# EAGLE design mainBoard (EAGLE 9.6.2)
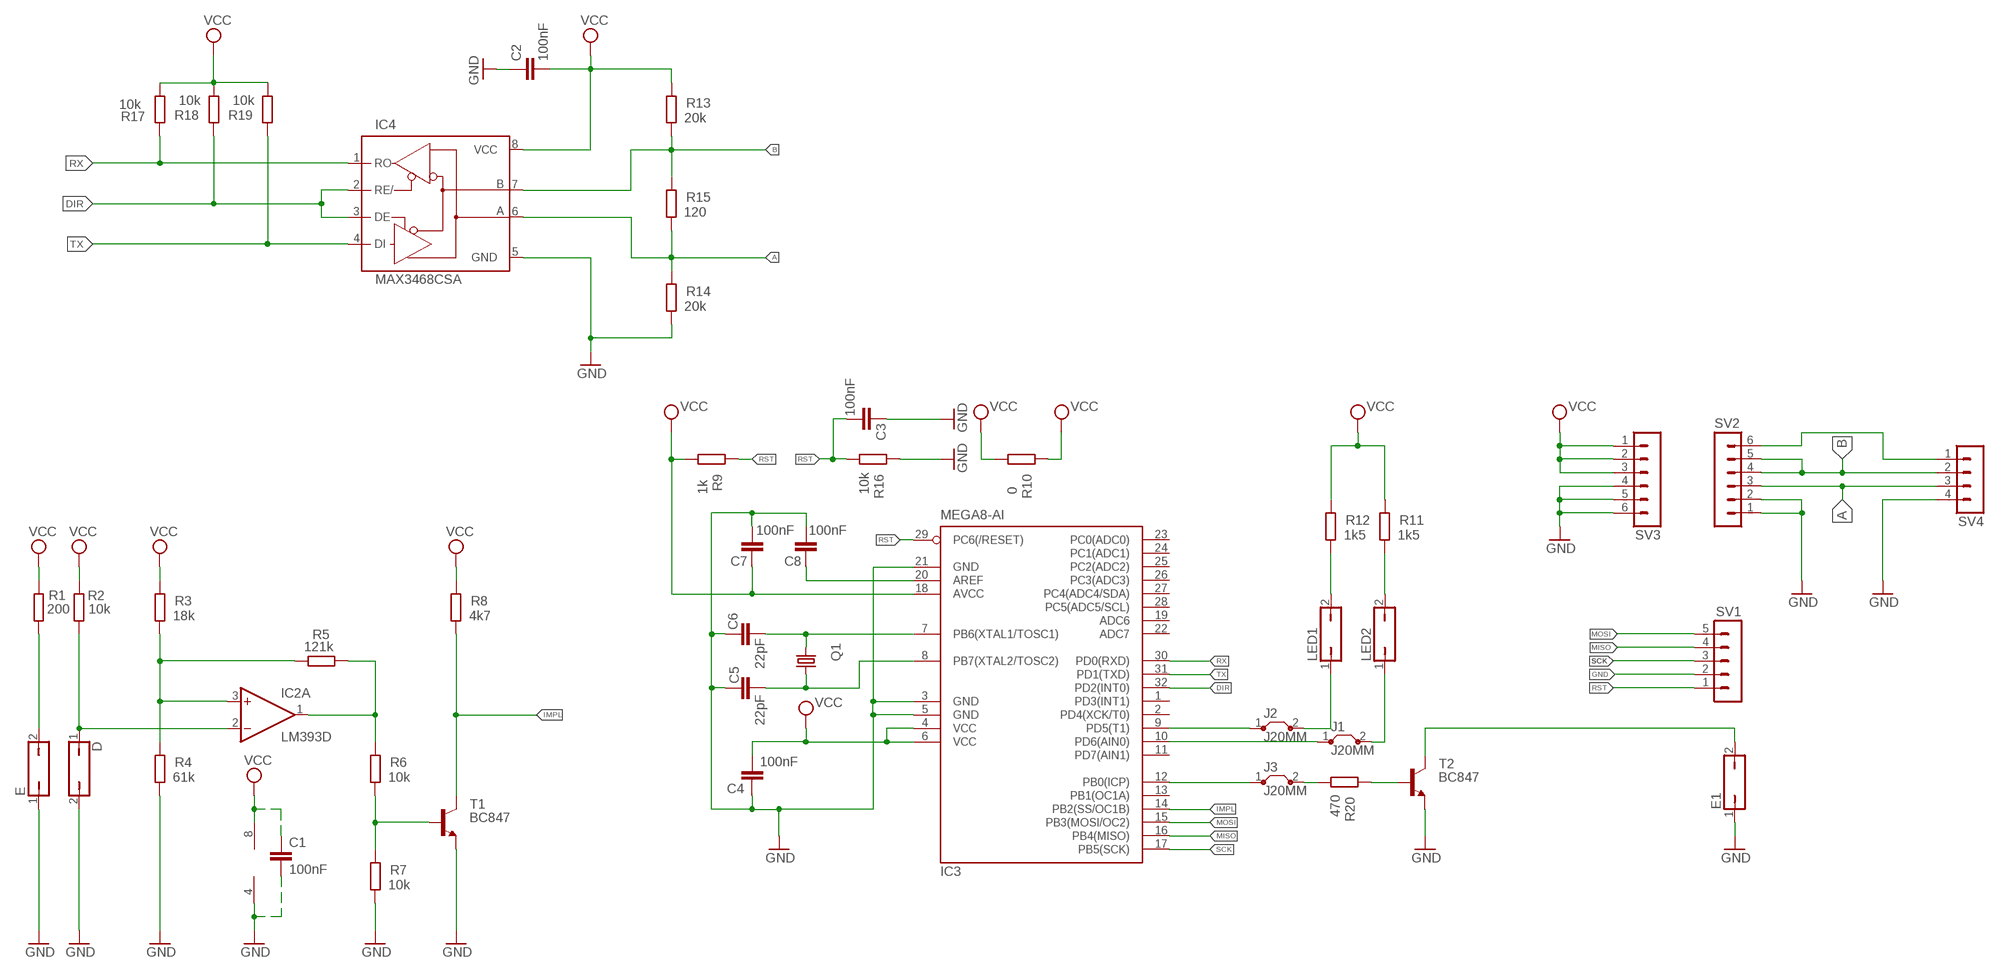
[diagram p0: schematic, sheet 1]

## Parts
C1  100nF  C-EUC1206K  [C1206K]
C2  100nF  C-EUC1206K  [C1206K]
C3  100nF  C-EUC1206K  [C1206K]
C4  100nF  C-EUC1206K  [C1206K]
C5  22pF  C-EUC1206K  [C1206K]
C6  22pF  C-EUC1206K  [C1206K]
C7  100nF  C-EUC1206K  [C1206K]
C8  100nF  C-EUC1206K  [C1206K]
D  JP1Q  [JP1]
E  JP1Q  [JP1]
E1  JP1Q  [JP1]
IC2  LM393D  [SO08]
IC3  MEGA8-AI  [TQFP32-08]
IC4  MAX3468CSA  [SO08]
J1  J20MM  [20]
J2  J20MM  [20]
J3  J20MM  [20]
LED1  JP1Q  [JP1]
LED2  JP1Q  [JP1]
Q1  CRYSTALSM49  [SM49]
R1  200  R-EU_M1206  [M1206]
R2  10k  R-EU_M1206  [M1206]
R3  18k  R-EU_M1206  [M1206]
R4  61k  R-EU_M1206  [M1206]
R5  121k  R-EU_M1206  [M1206]
R6  10k  R-EU_M1206  [M1206]
R7  10k  R-EU_M1206  [M1206]
R8  4k7  R-EU_M1206  [M1206]
R9  1k  R-EU_M1206  [M1206]
R10  0  R-EU_M1206  [M1206]
R11  1k5  R-EU_M1206  [M1206]
R12  1k5  R-EU_M1206  [M1206]
R13  20k  R-EU_M1206  [M1206]
R14  20k  R-EU_M1206  [M1206]
R15  120  R-EU_M1206  [M1206]
R16  10k  R-EU_M1206  [M1206]
R17  10k  R-EU_M1206  [M1206]
R18  10k  R-EU_M1206  [M1206]
R19  10k  R-EU_M1206  [M1206]
R20  470  R-EU_M1206  [M1206]
SV1  MA05-1  [MA05-1]
SV2  MA06-1  [MA06-1]
SV3  MA06-1  [MA06-1]
SV4  MA04-1  [MA04-1]
T1  BC847  [SOT23]
T2  BC847  [SOT23]

## Nets
A: IC4.6(A) R14.2 R15.1 SV2.3 SV4.3
B: IC4.7(B) R13.1 R15.2 SV2.4 SV2.5 SV4.2
DIR: IC3.32(PD2(INT0)) IC4.2(RE/) IC4.3(DE) R18.2
GND: C1.2 C2.1 C3.1 C4.1 C5.1 C6.1 C7.2 C8.2 D.2 E1.1 E.1 IC2.4(P:V-) IC3.3(GND) IC3.5(GND) IC3.21(GND) IC4.5(GND) R4.1 R7.1 R14.1 R16.2 SV1.2 SV2.1 SV2.2 SV3.4 SV3.5 SV3.6 SV4.4 T1.2(E) T2.2(E)
IMPL: IC3.14(PB2(SS/OC1B)) R8.1 T1.3(C)
MISO: IC3.16(PB4(MISO)) SV1.4
MOSI: IC3.15(PB3(MOSI/OC2)) SV1.5
N$1: E.2 R1.1
N$2: D.1 IC2.2(A:-IN) R2.2
N$3: IC2.3(A:+IN) R3.1 R4.2 R5.2
N$4: R6.1 R7.2 T1.1(B)
N$5: IC2.1(A:OUT) R5.1 R6.2
N$6: SV2.6 SV4.1
N$7: LED2.2 R11.1
N$8: LED1.2 R12.1
N$9: C5.2 IC3.8(PB7(XTAL2/TOSC2)) Q1.1
N$10: C8.1 IC3.20(AREF)
N$11: C6.2 IC3.7(PB6(XTAL1/TOSC1)) Q1.2
N$12: J2.2 LED1.1
N$14: J1.2 LED2.1
N$15: IC3.9(PD5(T1)) J2.1
N$16: IC3.10(PD6(AIN0)) J1.1
N$17: IC3.12(PB0(ICP)) J3.1
N$18: J3.2 R20.1
N$19: E1.2 T2.3(C)
N$20: R20.2 T2.1(B)
RST: C3.2 IC3.29(PC6(/RESET)) R9.2 R16.1 SV1.1
RX: IC3.30(PD0(RXD)) IC4.1(RO) R17.1
SCK: IC3.17(PB5(SCK)) SV1.3
TX: IC3.31(PD1(TXD)) IC4.4(DI) R19.2
VCC: C1.1 C2.2 C4.2 C7.1 IC2.8(P:V+) IC3.4(VCC) IC3.6(VCC) IC3.18(AVCC) IC4.8(VCC) R1.2 R2.1 R3.2 R8.2 R9.1 R10.1 R10.2 R11.2 R12.2 R13.2 R17.2 R18.1 R19.1 SV3.1 SV3.2 SV3.3
Unconnected: IC2.5(B:+IN) IC2.6(B:-IN) IC2.7(B:OUT) IC3.1(PD3(INT1)) IC3.2(PD4(XCK/T0)) IC3.11(PD7(AIN1)) IC3.13(PB1(OC1A)) IC3.19(ADC6) IC3.22(ADC7) IC3.23(PC0(ADC0)) IC3.24(PC1(ADC1)) IC3.25(PC2(ADC2)) IC3.26(PC3(ADC3)) IC3.27(PC4(ADC4/SDA)) IC3.28(PC5(ADC5/SCL))

## Library data of the parts
C1-C8 = rcl:C-EU: CAPACITOR, European symbol; SPICEPREFIX: C
D E E1 LED1 LED2 = jumper:JP1Q: JUMPER
IC2 = linear3:LM393: COMPARATOR
IC3 = atmel:MEGA8: MICROCONTROLLER 8 Kbytes FLASH, 1 kbytes SRAM, 512 bytes EEPROM, USART, 6-channel 10 bit ADC, 2-channel 8 bit ADC Pin compatible with Atmega48, ATMega88, ATMega168 Source: avr.lbr; MPN: ATMEGA8-16AU; OC_FARNELL: 9171371; OC_NEWARK: 73M8863
IC4 = maxim:MAX34*: +5V, Fail-Safe, 40Mbps, Profibus RS-485/RS-422 Transceivers Source: MAX3465-MAX3469.pdf; MPN: MAX3468CSA+; OC_FARNELL: unknown; OC_NEWARK: 76K6721
J1-J3 = jumper:J: Bridge
Q1 = crystal:CRYSTAL: CRYSTAL; OC_FARNELL: unknown; OC_NEWARK: unknown
R1-R20 = rcl:R-EU_: RESISTOR, European symbol; SPICEPREFIX: R
SV1 = con-lstb:MA05-1: PIN HEADER; OC_FARNELL: unknown; OC_NEWARK: unknown
SV2 SV3 = con-lstb:MA06-1: PIN HEADER; OC_FARNELL: unknown; OC_NEWARK: unknown
SV4 = con-lstb:MA04-1: PIN HEADER; OC_FARNELL: unknown; OC_NEWARK: unknown
T1 T2 = transistor:BC847: NPN TRANSISTOR

## Module POWERDC/DC
Ports: 

### Library data of the parts

## Board
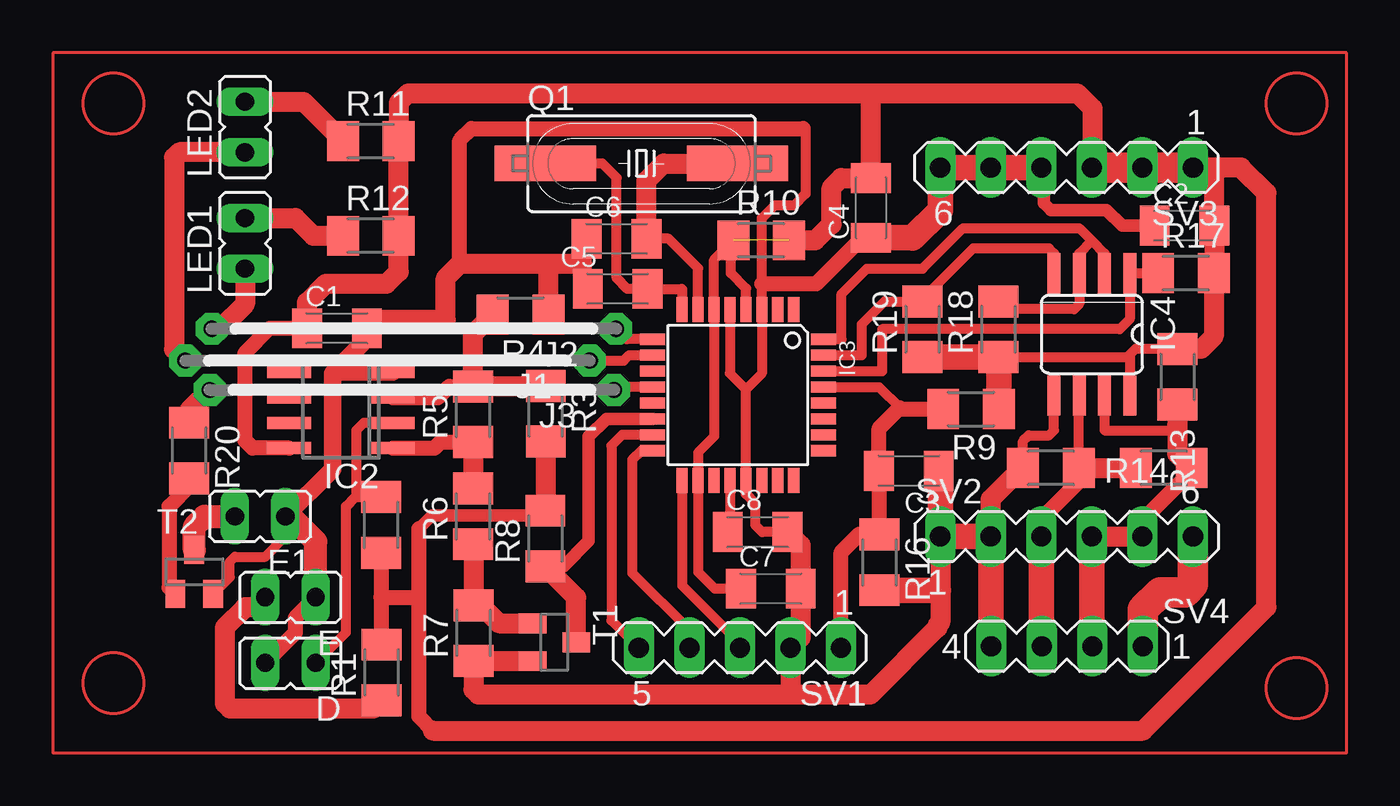
[diagram p1: board, top side]

No outline drawn. Coordinates in mm, seen from the top.
Copper layers (1*16): Top 0.035mm / dielectric 1.5mm / Bottom 0.035mm
Design rules "default *": minimum track width 20mil, minimum drill 0.35mm, track to track 6mil, track to pad 6mil, pad to pad 6mil, via to via 6mil, smd to smd 6mil, copper to edge 40mil, drill to drill 6mil, minimum pad ring 10mil, minimum via ring 8mil, stop-mask expansion 4mil, vias tented up to drill 0mil, thermal gap 10mil

### Footprints (pad centres in the part's own frame; a part is rotated, then mirrored left to right if it is on the bottom)
C1206K = smd 1.5 x 2: 1 -1.5,0; 2 1.5,0
JP1 = drill 0.914 long: 1 0,-1.27; 2 0,1.27
SO08 = smd 0.6 x 2.2: 1 -1.905,-2.6; 2 -0.635,-2.6; 3 0.635,-2.6; 4 1.905,-2.6; 5 1.905,2.6; 6 0.635,2.6; 7 -0.635,2.6; 8 -1.905,2.6
TQFP32-08 = smd 1.27 x 0.559: 1 -4.293,2.8; 2 -4.293,2; 3 -4.293,1.2; 4 -4.293,0.4; 5 -4.293,-0.4; 6 -4.293,-1.2; 7 -4.293,-2; 8 -4.293,-2.8; 17 4.293,-2.8; 18 4.293,-2; 19 4.293,-1.2; 20 4.293,-0.4; 21 4.293,0.4; 22 4.293,1.2; 23 4.293,2; 24 4.293,2.8 | smd 0.559 x 1.27: 9 -2.8,-4.293; 10 -2,-4.293; 11 -1.2,-4.293; 12 -0.4,-4.293; 13 0.4,-4.293; 14 1.2,-4.293; 15 2,-4.293; 16 2.8,-4.293; 25 2.8,4.293; 26 2,4.293; 27 1.2,4.293; 28 0.4,4.293; 29 -0.4,4.293; 30 -1.2,4.293; 31 -2,4.293; 32 -2.8,4.293
SO08' = smd 0.66 x 2.032: 1 -1.905,-3.073; 2 -0.635,-3.073; 3 0.635,-3.073; 4 1.905,-3.073; 5 1.905,3.073; 6 0.635,3.073; 7 -0.635,3.073; 8 -1.905,3.073
20 = drill 0.813 pad 1.6 octagon: 1 -10.16,0; 2 10.16,0
SM49 = smd 5.08 x 1.778: 1 -4.826,0; 2 4.826,0
M1206 = smd 1.6 x 2: 1 -1.4,0; 2 1.4,0
MA05-1 = drill 1.016 long: 1 -5.08,0; 2 -2.54,0; 3 0,0; 4 2.54,0; 5 5.08,0
MA06-1 = drill 1.016 long: 1 -6.35,0; 2 -3.81,0; 3 -1.27,0; 4 1.27,0; 5 3.81,0; 6 6.35,0
MA04-1 = drill 1.016 long: 1 -3.81,0; 2 -1.27,0; 3 1.27,0; 4 3.81,0
SOT23 = smd 1 x 1.4: 1 -0.95,-1.1; 2 0.95,-1.1; 3 0,1.1

### Placement (x,y rotation side)
C1  9.19,20.37 0 top
C2  51.77,25.53 0 top
C3  37.92,13.21 180 top
C4  36.02,26.42 90 top
C5  23.29,22.35 0 top
C6  23.24,24.87 0 top
C7  30.99,7.29 0 top
C8  30.33,10.13 0 top
D  6.86,3.56 90 top
E  6.86,6.86 90 top
E1  5.33,10.92 90 top
IC2  9.4,16.26 90 top
IC3  29.34,17.02 270 top
IC4  MAX3468CSA  [SO08']  47.12,20.07 180 top
J1  11.73,18.75 180 top
J2  13.06,20.35 180 top
J3  12.95,17.27 180 top
LED1  4.57,24.64 0 top
LED2  4.57,30.48 0 top
Q1  24.49,28.65 0 top
R1  11.43,3.07 90 top
R2  11.4,10.49 90 top
R3  19.68,16.08 270 top
R4  18.41,21.06 180 top
R5  16.03,16.05 90 top
R6  16.03,10.92 90 top
R7  16.05,5.05 90 top
R8  19.66,9.8 90 top
R9  41.05,16.31 180 top
R10  30.51,24.79 0 top
R11  10.9,29.77 0 top
R12  10.9,25.02 0 top
R13  51.41,17.93 90 top
R14  45.06,13.36 0 top
R15  50.72,13.36 0 top
R16  36.45,8.61 270 top
R17  51.84,23.14 0 top
R18  42.42,20.32 90 top
R19  38.61,20.32 90 top
R20  1.78,14.22 270 top
SV1  29.44,4.32 180 top
SV2  45.85,9.91 0 top
SV3  45.85,28.45 180 top
SV4  45.87,4.39 180 top
T1  20.12,4.6 270 top
T2  2.03,8.13 0 top

### Tracks (layer width: path | path; a pad name or v marks a point on that pad's centre or on a via)
A
  Top 0.508: 46.48,13.38 R14.2 | R14.2 46.46,16.97 IC4.6 | R14.2 46.61,13.21 46.61,12.83
  Top 0.762: SV2.3 44.58,10.79 46.61,12.83
  Top 1.016: R14.2 R15.1
  Top 1.27: SV2.3 44.58,4.42 SV4.3
B
  Top 0.508: IC4.7 47.75,15.24 51.16,15.24 51.41,15.49
  Top 0.762: R15.2 52.3,13.36 49.66,10.72
  Top 1.016: 47.12,9.96 SV2.4 SV2.5 49.66,10.72 | R13.1 51.41,15.49 51.41,14.07 R15.2
  Top 1.27: SV2.4 47.12,4.42 SV4.2
DIR
  Top 0.508: IC3.32 34.54,19.82 34.54,22.1 35.81,23.37 38.61,23.37 40.64,25.4 46.48,25.4 47.12,24.77 | 47.12,24.77 46.48,24.13 IC4.3 46.48,21.59 46.23,21.34 42.8,21.34 R18.2 | 47.78,23.16 IC4.2 47.75,24.13 47.12,24.77
GND
  Top 0.508: 21.79,22.94 C5.1 21.74,22.4 21.74,23.37 | 19.84,21.08 R4.1 | 29.74,17.3 IC3.21 29.74,12.04 30.2,11.57 30.2,10.49 30.56,10.13 C8.2 | 29.74,17.3 28.93,18.11 28.94,18.12 IC3.5 | C6.1 21.74,23.37 | SV4.4 42.04,4.42 | 21.74,23.37 21.51,23.6 | 29.74,17.3 30.54,18.1 IC3.3 30.54,22.61 30.54,25.91 31.17,26.54 32.16,26.54 32.74,27.13 32.74,30.28 32.61,30.4 | C1.2 11.13,20.8 | 43.63,13.39 R14.1 43.66,14.7 43.94,14.99 44.96,14.99 45.21,15.24 IC4.5 | SV3.5 42.16,28.32 | 50.62,25.09 C2.1 | T2.2 3.81,7.86 3.81,8.64 4.06,8.89 5.59,8.89 6.6,9.91 E1.1
  Top 0.635: SV3.4 44.7,28.32 44.7,26.67 45.06,26.31 47.85,26.31 48.64,25.53 C2.1
  Top 0.762: 32.61,30.4 15.95,30.4 15.37,29.82 15.37,23.6 | 35.48,24.92 C4.1 35.58,24.92 33.27,22.61 30.54,22.61 | 39.4,7.21 39.5,7.11 | D.2 7.11,5.08 7.11,5.84 E.1
  Top 0.889: C1.2 10.7,19.84 9.02,18.16 | E1.1 8.97,13.28 8.97,18.11 9.02,18.16 | IC2.4 9.02,18.16
  Top 1.016: 21.51,23.6 19.76,23.6 | R4.1 19.82,23.54 19.76,23.6 | 11.13,20.8 14.66,20.8 14.66,22.89 15.37,23.6 19.76,23.6 | T1.2 R7.1 16.05,2.21 16.31,1.96 32,1.96 | SV2.1 39.5,7.11 39.5,5.59 39.37,5.46 39.37,5.33 35.99,1.96 32,1.96 | SV2.2 42.04,11.79 43.63,13.39 | C8.2 32.49,9.47 C7.2 32.49,4.83 SV1.2 31.98,1.98 32,1.96
  Top 1.143: E.1 8.13,9.65 6.86,10.92 E1.1
  Top 1.27: SV3.4 SV3.5 SV3.6 39.5,26.29 38.1,24.89 38.08,24.92 C4.1 | 42.04,4.42 SV2.2 SV2.1 39.5,13.13 C3.1 | R16.2 39.4,7.21
IMPL
  Top 0.635: R8.1 20.57,8.4 21.84,9.68 21.84,14.94 22.73,15.82 IC3.14
  Top 1.016: T1.3 21.22,6.85 R8.1
MISO
  Top 0.508: IC3.16 24.48,14.22 24.03,13.77 24.03,8.08 26.9,5.21 SV1.4
MOSI
  Top 0.508: IC3.15 23.53,15.02 22.99,14.48 22.99,5.69 SV1.5
N$1
  Top 1.016: E.2 5.08,6.35 4.57,6.35 3.56,5.33 3.56,1.52 3.81,1.27 11.03,1.27 R1.1
N$2
  Top 0.508: 11.97,15.6 IC2.2 10.54,15.62 10.16,15.24 10.16,11.89 | D.1 9.65,5.08 9.65,11.43 10.11,11.89 10.16,11.89 | 10.16,11.89 R2.2
N$3
  Top 0.762: IC2.3 14.28,16.89 14.84,17.45 R5.2
  Top 1.016: R3.1 16.05,17.48 R5.2 16.03,20.07 R4.2
N$4
  Top 0.508: 18.96,5.55 T1.1
  Top 1.016: R6.1 16.05,9.5 R7.2 16.43,6.46 17.34,5.55 18.96,5.55
N$5
  Top 0.762: IC2.1 14.1,14.35 14.4,14.65 R5.1
  Top 1.016: R5.1 R6.2
N$6
  Top 1.524: SV4.1 49.68,6.25 50.55,7.11 51.82,7.11 52.2,7.49 SV2.6
N$7
  Top 1.016: R11.1 7.51,31.75 LED2.2
N$8
  Top 0.508: 9.47,24.99 R12.1
  Top 1.016: LED1.2 7.11,25.91 8,25.02 R12.1
N$9
  Top 0.508: Q1.1 22.53,28.65 23.24,27.94 23.24,22.89 23.77,22.35 C5.2 26.52,22.35 26.54,22.33 IC3.8
N$10
  Top 0.508: IC3.20 28.94,10.24 C8.1
N$11
  Top 0.508: IC3.7 27.34,23.39 25.86,24.87 C6.2
  Top 1.016: C6.2 24.74,27.79 25.6,28.65 Q1.2
N$12
  Top 1.016: LED1.1 4.57,21.59 3.33,20.34 J2.2
N$13
  Top 0.152: -5.08,-0.96 59.92,-0.96 59.92,34.21 -5.08,34.21 -5.08,-0.96
N$14
  Top 1.016: LED2.1 1.27,29.21 1.02,28.96 1.02,19.3 J1.2
N$15
  Top 0.508: IC3.9 23.74,19.82 J2.1
N$16
  Top 0.508: J1.1 23.6,18.75 23.88,19.02 IC3.10
N$17
  Top 0.508: IC3.12 23.26,17.42 J3.1
N$18
  Top 1.016: J3.2 1.78,16.26 R20.1
N$19
  Top 1.143: T2.3 2.03,10.41 2.54,10.92 E1.2
N$20
  Top 0.762: R20.2 1.78,12.45 0.76,11.43 0.76,7.35 T2.1
RST
  Top 0.508: R9.2 39.22,16.31 | 36.83,13.21 C3.2 | IC3.29 36.43,17.42 37.47,16.38
  Top 0.762: SV1.1 34.52,9.12 35.44,10.04 36.42,10.04 | R16.1 36.45,13.18 C3.2 36.42,15.34 37.39,16.31 | 37.39,16.31 R9.2 | 37.39,16.31 37.47,16.38
  Top 1.27: 36.42,10.04 R16.1
RX
  Top 0.508: IC3.30 36.58,18.22 36.58,20.32 48.51,20.32 49.02,20.83 IC4.1 R17.1
SCK
  Top 0.508: IC3.17 26.54,7.45 29.44,4.55 SV1.3
TX
  Top 0.508: 45.21,22.96 IC4.4 45.21,24.13 44.96,24.38 41.15,24.38 38.61,21.84 R19.2 36.71,21.72 35.56,20.57 35.56,19.02 IC3.31
VCC  (1 unrouted)
  Top 0.508: 49.02,16.82 IC4.8 49.05,17.02 49.02,17.04 49.02,19.05 | 27.36,12.71 IC3.18 | IC3.18 27.34,8.12 28.17,7.29 C7.1 | R3.2 19.66,14.65 | 19.43,10.97 R8.2 | IC3.4 | IC3.18 27.34,14.13 28.14,14.94 IC3.6 28.14,23.82 R10.1 28.98,24.67 28.98,23.14 29.74,22.38 29.74,22.37 IC3.4 | 51.36,19.33 R13.2 49.3,19.33 49.02,19.05 | 53.42,28.27 53.59,28.45 | 53.19,23.19 R17.2 | R18.1 48.89,18.92 49.02,19.05 | R1.2 11.53,4.57 | R2.1 11.43,9.06
  Top 0.635: 13.31,10.31 13.97,10.97 19.43,10.97
  Top 0.762: 35.99,27.94 C4.2 | IC2.8 4.95,14.35 4.57,14.73 4.57,19.13 5.82,20.37 C1.1 | 13.31,6.86 13.31,0.86 14.02,0.15 | 13.31,6.86 13.31,10.31 | R2.1 11.4,6.86 | 11.4,6.86 11.4,4.5 R1.2 | 11.4,6.86 13.31,6.86
  Top 1.016: 36.02,32.18 12.78,32.18 12.3,31.7 R11.2 R12.2 12.3,23.22 11.68,22.61 8.64,22.61 7.7,21.66 C1.1 | 36.02,32.18 46.38,32.18 47.14,31.42 47.14,28.47 SV3.3 | 36.02,32.18 C4.2 34.52,27.92 34.04,27.43 34.04,25.6 33.22,24.79 R10.2 | R3.2 19.68,11.23 R8.2 | 14.02,0.15 49.68,0.15 55.88,6.35 55.88,27.18 54.61,28.45 53.59,28.45 | 53.59,28.45 SV3.1 | 51.36,19.33 52.61,19.33 53.24,19.97 R17.2 53.27,23.16 C2.2 53.27,28.12 53.59,28.45
  Top 1.27: R9.1 42.45,18.89 R18.1 R19.1
  Top 1.524: SV3.1 SV3.2 SV3.3
(copper drawn outside any net)
  shapes: Top circle x4